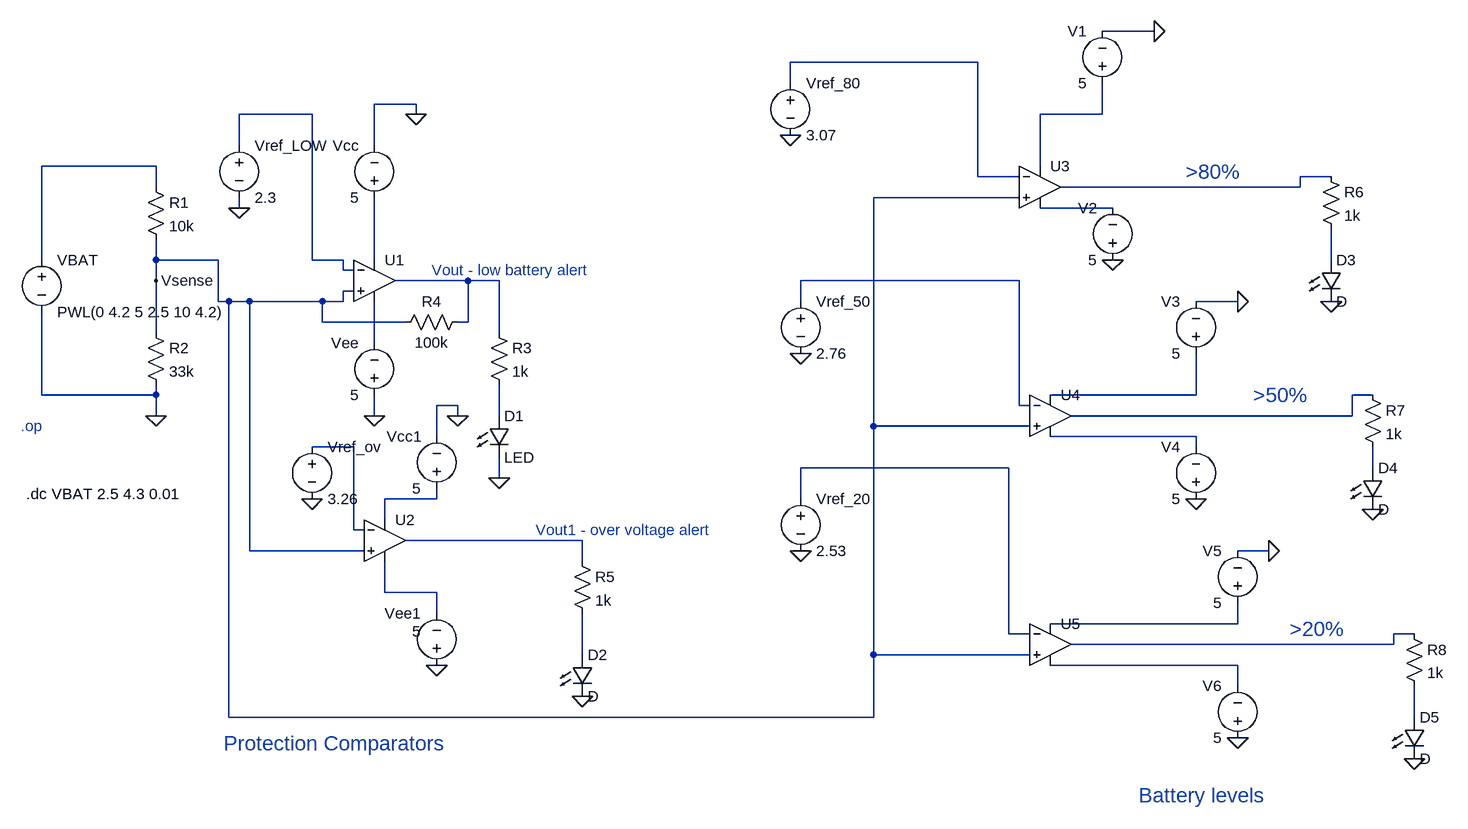
[diagram p0: schematic Battery_monitoring_and_protection_system.asc]
Battery_monitoring_and_protection_system.asc, the LTspice schematic file:
Version 4
SHEET 1 2252 956
WIRE 1792 -240 1712 -240
WIRE 1520 -192 1232 -192
WIRE 1232 -160 1232 -192
WIRE 656 -128 592 -128
WIRE 496 -112 384 -112
WIRE 656 -112 656 -128
WIRE 1712 -112 1712 -160
WIRE 1712 -112 1616 -112
WIRE 384 -64 384 -112
WIRE 592 -64 592 -128
WIRE 256 -32 80 -32
WIRE 1616 -32 1616 -112
WIRE 1520 -16 1520 -192
WIRE 1584 -16 1520 -16
WIRE 2064 -16 2016 -16
WIRE 256 0 256 -32
WIRE 2016 0 2016 -16
WIRE 2016 0 1648 0
WIRE 1584 16 1360 16
WIRE 384 32 384 16
WIRE 1728 32 1616 32
WIRE 80 112 80 -32
WIRE 256 112 256 80
WIRE 352 112 256 112
WIRE 496 112 496 -112
WIRE 544 112 496 112
WIRE 592 112 592 16
WIRE 2064 112 2064 64
WIRE 544 128 544 112
WIRE 560 128 544 128
WIRE 256 144 256 112
WIRE 736 144 624 144
WIRE 784 144 736 144
WIRE 1584 144 1248 144
WIRE 560 160 544 160
WIRE 352 176 352 112
WIRE 368 176 352 176
WIRE 400 176 368 176
WIRE 512 176 400 176
WIRE 544 176 544 160
WIRE 544 176 512 176
WIRE 1248 176 1248 144
WIRE 1920 176 1856 176
WIRE 512 208 512 176
WIRE 640 208 512 208
WIRE 736 208 736 144
WIRE 736 208 720 208
WIRE 256 224 256 144
WIRE 784 224 784 144
WIRE 592 240 592 176
WIRE 80 320 80 192
WIRE 256 320 256 304
WIRE 256 320 80 320
WIRE 1856 320 1856 256
WIRE 1856 320 1632 320
WIRE 2128 320 2096 320
WIRE 720 336 688 336
WIRE 1584 336 1584 144
WIRE 1600 336 1584 336
WIRE 256 352 256 320
WIRE 592 352 592 320
WIRE 720 352 720 336
WIRE 784 352 784 304
WIRE 2096 352 2096 320
WIRE 2096 352 1664 352
WIRE 1360 368 1360 16
WIRE 1600 368 1360 368
WIRE 688 384 688 336
WIRE 1856 384 1632 384
WIRE 560 400 496 400
WIRE 1856 400 1856 384
WIRE 1568 432 1248 432
WIRE 2128 432 2128 400
WIRE 784 448 784 416
WIRE 688 480 688 464
WIRE 688 480 608 480
WIRE 1248 480 1248 432
WIRE 608 512 608 480
WIRE 560 528 560 400
WIRE 576 528 560 528
WIRE 912 544 640 544
WIRE 400 560 400 176
WIRE 576 560 400 560
WIRE 1968 560 1920 560
WIRE 912 576 912 544
WIRE 608 624 608 576
WIRE 688 624 608 624
WIRE 688 656 688 624
WIRE 1920 672 1920 640
WIRE 1920 672 1632 672
WIRE 1568 688 1568 432
WIRE 1600 688 1568 688
WIRE 2192 688 2160 688
WIRE 2160 704 2160 688
WIRE 2160 704 1664 704
WIRE 912 720 912 656
WIRE 1360 720 1360 368
WIRE 1600 720 1360 720
WIRE 1920 736 1632 736
WIRE 1920 768 1920 736
WIRE 368 816 368 176
WIRE 1360 816 1360 720
WIRE 1360 816 368 816
WIRE 2192 816 2192 768
FLAG 256 144 Vsense
FLAG 256 352 0
FLAG 384 32 0
FLAG 784 448 0
FLAG 656 -112 0
FLAG 592 352 0
FLAG 496 480 0
FLAG 688 736 0
FLAG 720 352 0
FLAG 912 784 0
FLAG 1232 -80 0
FLAG 1248 256 0
FLAG 1248 560 0
FLAG 1728 112 0
FLAG 1856 480 0
FLAG 1920 848 0
FLAG 1968 560 0
FLAG 1920 176 0
FLAG 1792 -240 0
FLAG 2064 176 0
FLAG 2128 496 0
FLAG 2192 880 0
SYMBOL voltage 80 96 R0
WINDOW 123 0 0 Left 0
WINDOW 39 0 0 Left 0
SYMATTR InstName VBAT
SYMATTR Value PWL(0 4.2 5 2.5 10 4.2)
SYMBOL res 240 -16 R0
SYMATTR InstName R1
SYMATTR Value 10k
SYMBOL res 240 208 R0
SYMATTR InstName R2
SYMATTR Value 33k
SYMBOL voltage 384 -80 R0
WINDOW 123 0 0 Left 0
WINDOW 39 0 0 Left 0
SYMATTR InstName Vref_LOW
SYMATTR Value 2.3
SYMBOL res 768 208 R0
SYMATTR InstName R3
SYMATTR Value 1k
SYMBOL LED 768 352 R0
SYMATTR InstName D1
SYMATTR Value LED
SYMBOL OpAmps\\UniversalOpAmp2 592 144 R0
SYMATTR InstName U1
SYMBOL voltage 592 32 R180
WINDOW 0 24 96 Left 2
WINDOW 3 24 16 Left 2
WINDOW 123 0 0 Left 0
WINDOW 39 0 0 Left 0
SYMATTR InstName Vcc
SYMATTR Value 5
SYMBOL voltage 592 336 R180
WINDOW 0 24 96 Left 2
WINDOW 3 24 16 Left 2
SYMATTR InstName Vee
SYMATTR Value 5
SYMBOL res 736 192 R90
WINDOW 0 0 56 VBottom 2
WINDOW 3 32 56 VTop 2
SYMATTR InstName R4
SYMATTR Value 100k
SYMBOL OpAmps\\UniversalOpAmp2 608 544 R0
SYMATTR InstName U2
SYMBOL voltage 496 384 R0
SYMATTR InstName Vref_ov
SYMATTR Value 3.26
SYMBOL voltage 688 480 R180
WINDOW 0 24 96 Left 2
WINDOW 3 24 16 Left 2
WINDOW 123 0 0 Left 0
WINDOW 39 0 0 Left 0
SYMATTR InstName Vcc1
SYMATTR Value 5
SYMBOL voltage 688 752 R180
WINDOW 0 24 96 Left 2
WINDOW 3 24 68 Left 2
WINDOW 123 0 0 Left 0
WINDOW 39 0 0 Left 0
SYMATTR InstName Vee1
SYMATTR Value 5
SYMBOL res 896 560 R0
SYMATTR InstName R5
SYMATTR Value 1k
SYMBOL LED 896 720 R0
SYMATTR InstName D2
SYMBOL OpAmps\\UniversalOpAmp2 1616 0 R0
SYMATTR InstName U3
SYMBOL OpAmps\\UniversalOpAmp2 1632 352 R0
SYMATTR InstName U4
SYMBOL OpAmps\\UniversalOpAmp2 1632 704 R0
SYMATTR InstName U5
SYMBOL voltage 1232 -176 R0
SYMATTR InstName Vref_80
SYMATTR Value 3.07
SYMBOL voltage 1248 160 R0
SYMATTR InstName Vref_50
SYMATTR Value 2.76
SYMBOL voltage 1248 464 R0
SYMATTR InstName Vref_20
SYMATTR Value 2.53
SYMBOL voltage 1712 -144 R180
WINDOW 0 24 96 Left 2
WINDOW 3 24 16 Left 2
SYMATTR InstName V1
SYMATTR Value 5
SYMBOL voltage 1728 128 R180
WINDOW 0 24 96 Left 2
WINDOW 3 24 16 Left 2
SYMATTR InstName V2
SYMATTR Value 5
SYMBOL voltage 1856 272 R180
WINDOW 0 24 96 Left 2
WINDOW 3 24 16 Left 2
SYMATTR InstName V3
SYMATTR Value 5
SYMBOL voltage 1856 496 R180
WINDOW 0 24 96 Left 2
WINDOW 3 24 16 Left 2
SYMATTR InstName V4
SYMATTR Value 5
SYMBOL voltage 1920 656 R180
WINDOW 0 24 96 Left 2
WINDOW 3 24 16 Left 2
SYMATTR InstName V5
SYMATTR Value 5
SYMBOL voltage 1920 864 R180
WINDOW 0 24 96 Left 2
WINDOW 3 24 16 Left 2
SYMATTR InstName V6
SYMATTR Value 5
SYMBOL res 2048 -32 R0
SYMATTR InstName R6
SYMATTR Value 1k
SYMBOL res 2112 304 R0
SYMATTR InstName R7
SYMATTR Value 1k
SYMBOL res 2176 672 R0
SYMATTR InstName R8
SYMATTR Value 1k
SYMBOL LED 2048 112 R0
SYMATTR InstName D3
SYMBOL LED 2112 432 R0
SYMATTR InstName D4
SYMBOL LED 2176 816 R0
SYMATTR InstName D5
TEXT 680 128 Left 2 ;Vout - low battery alert
TEXT 48 368 Left 2 ;.op
TEXT 840 528 Left 2 ;Vout1 - over voltage alert
TEXT 56 472 Left 2 !.dc VBAT 2.5 4.3 0.01
TEXT 360 856 Left 3 ;Protection Comparators
TEXT 1840 -24 Left 3 ;>80%
TEXT 1944 320 Left 3 ;>50%
TEXT 2000 680 Left 3 ;>20%
TEXT 1768 936 Left 3 ;Battery levels

The netlist it stands for:
* Battery_monitoring_and_protection_system.asc
VBAT N004 0 PWL(0 4.2 5 2.5 10 4.2)
R1 N004 Vsense 10k
R2 Vsense 0 33k
Vref_LOW N002 0 2.3
R3 N009 N014 1k
D1 N014 0 LED
XU1 Vsense N002 N007 N011 N009 level2 Avol=1Meg GBW=10Meg Slew=10Meg Ilimit=25m Rail=0 Vos=0 En=0 Enk=0 In=0 Ink=0 Rin=500Meg  ; pins In+ In- V+ V- OUT
Vcc N007 0 5
Vee 0 N011 5
R4 N009 Vsense 100k
XU2 Vsense N016 N019 N021 N020 level2 Avol=1Meg GBW=10Meg Slew=10Meg Ilimit=25m Rail=0 Vos=0 En=0 Enk=0 In=0 Ink=0 Rin=500Meg  ; pins In+ In- V+ V- OUT
Vref_ov N016 0 3.26
Vcc1 N019 0 5
Vee1 0 N021 5
R5 N020 N024 1k
D2 N024 0 D
XU3 Vsense N001 N003 N006 N005 level2 Avol=1Meg GBW=10Meg Slew=10Meg Ilimit=25m Rail=0 Vos=0 En=0 Enk=0 In=0 Ink=0 Rin=500Meg  ; pins In+ In- V+ V- OUT
XU4 Vsense N010 N012 N015 N013 level2 Avol=1Meg GBW=10Meg Slew=10Meg Ilimit=25m Rail=0 Vos=0 En=0 Enk=0 In=0 Ink=0 Rin=500Meg  ; pins In+ In- V+ V- OUT
XU5 Vsense N017 N022 N025 N023 level2 Avol=1Meg GBW=10Meg Slew=10Meg Ilimit=25m Rail=0 Vos=0 En=0 Enk=0 In=0 Ink=0 Rin=500Meg  ; pins In+ In- V+ V- OUT
Vref_80 N001 0 3.07
Vref_50 N010 0 2.76
Vref_20 N017 0 2.53
V1 N003 0 5
V2 0 N006 5
V3 N012 0 5
V4 0 N015 5
V5 N022 0 5
V6 0 N025 5
R6 N005 N008 1k
R7 N013 N018 1k
R8 N023 N026 1k
D3 N008 0 D
D4 N018 0 D
D5 N026 0 D
.model D D
.lib standard.dio
* Vout - low battery alert
* .op
* Vout1 - over voltage alert
.dc VBAT 2.5 4.3 0.01
* Protection Comparators
* >80%
* >50%
* >20%
* Battery levels
.lib UniversalOpAmp2.lib
.backanno
.end